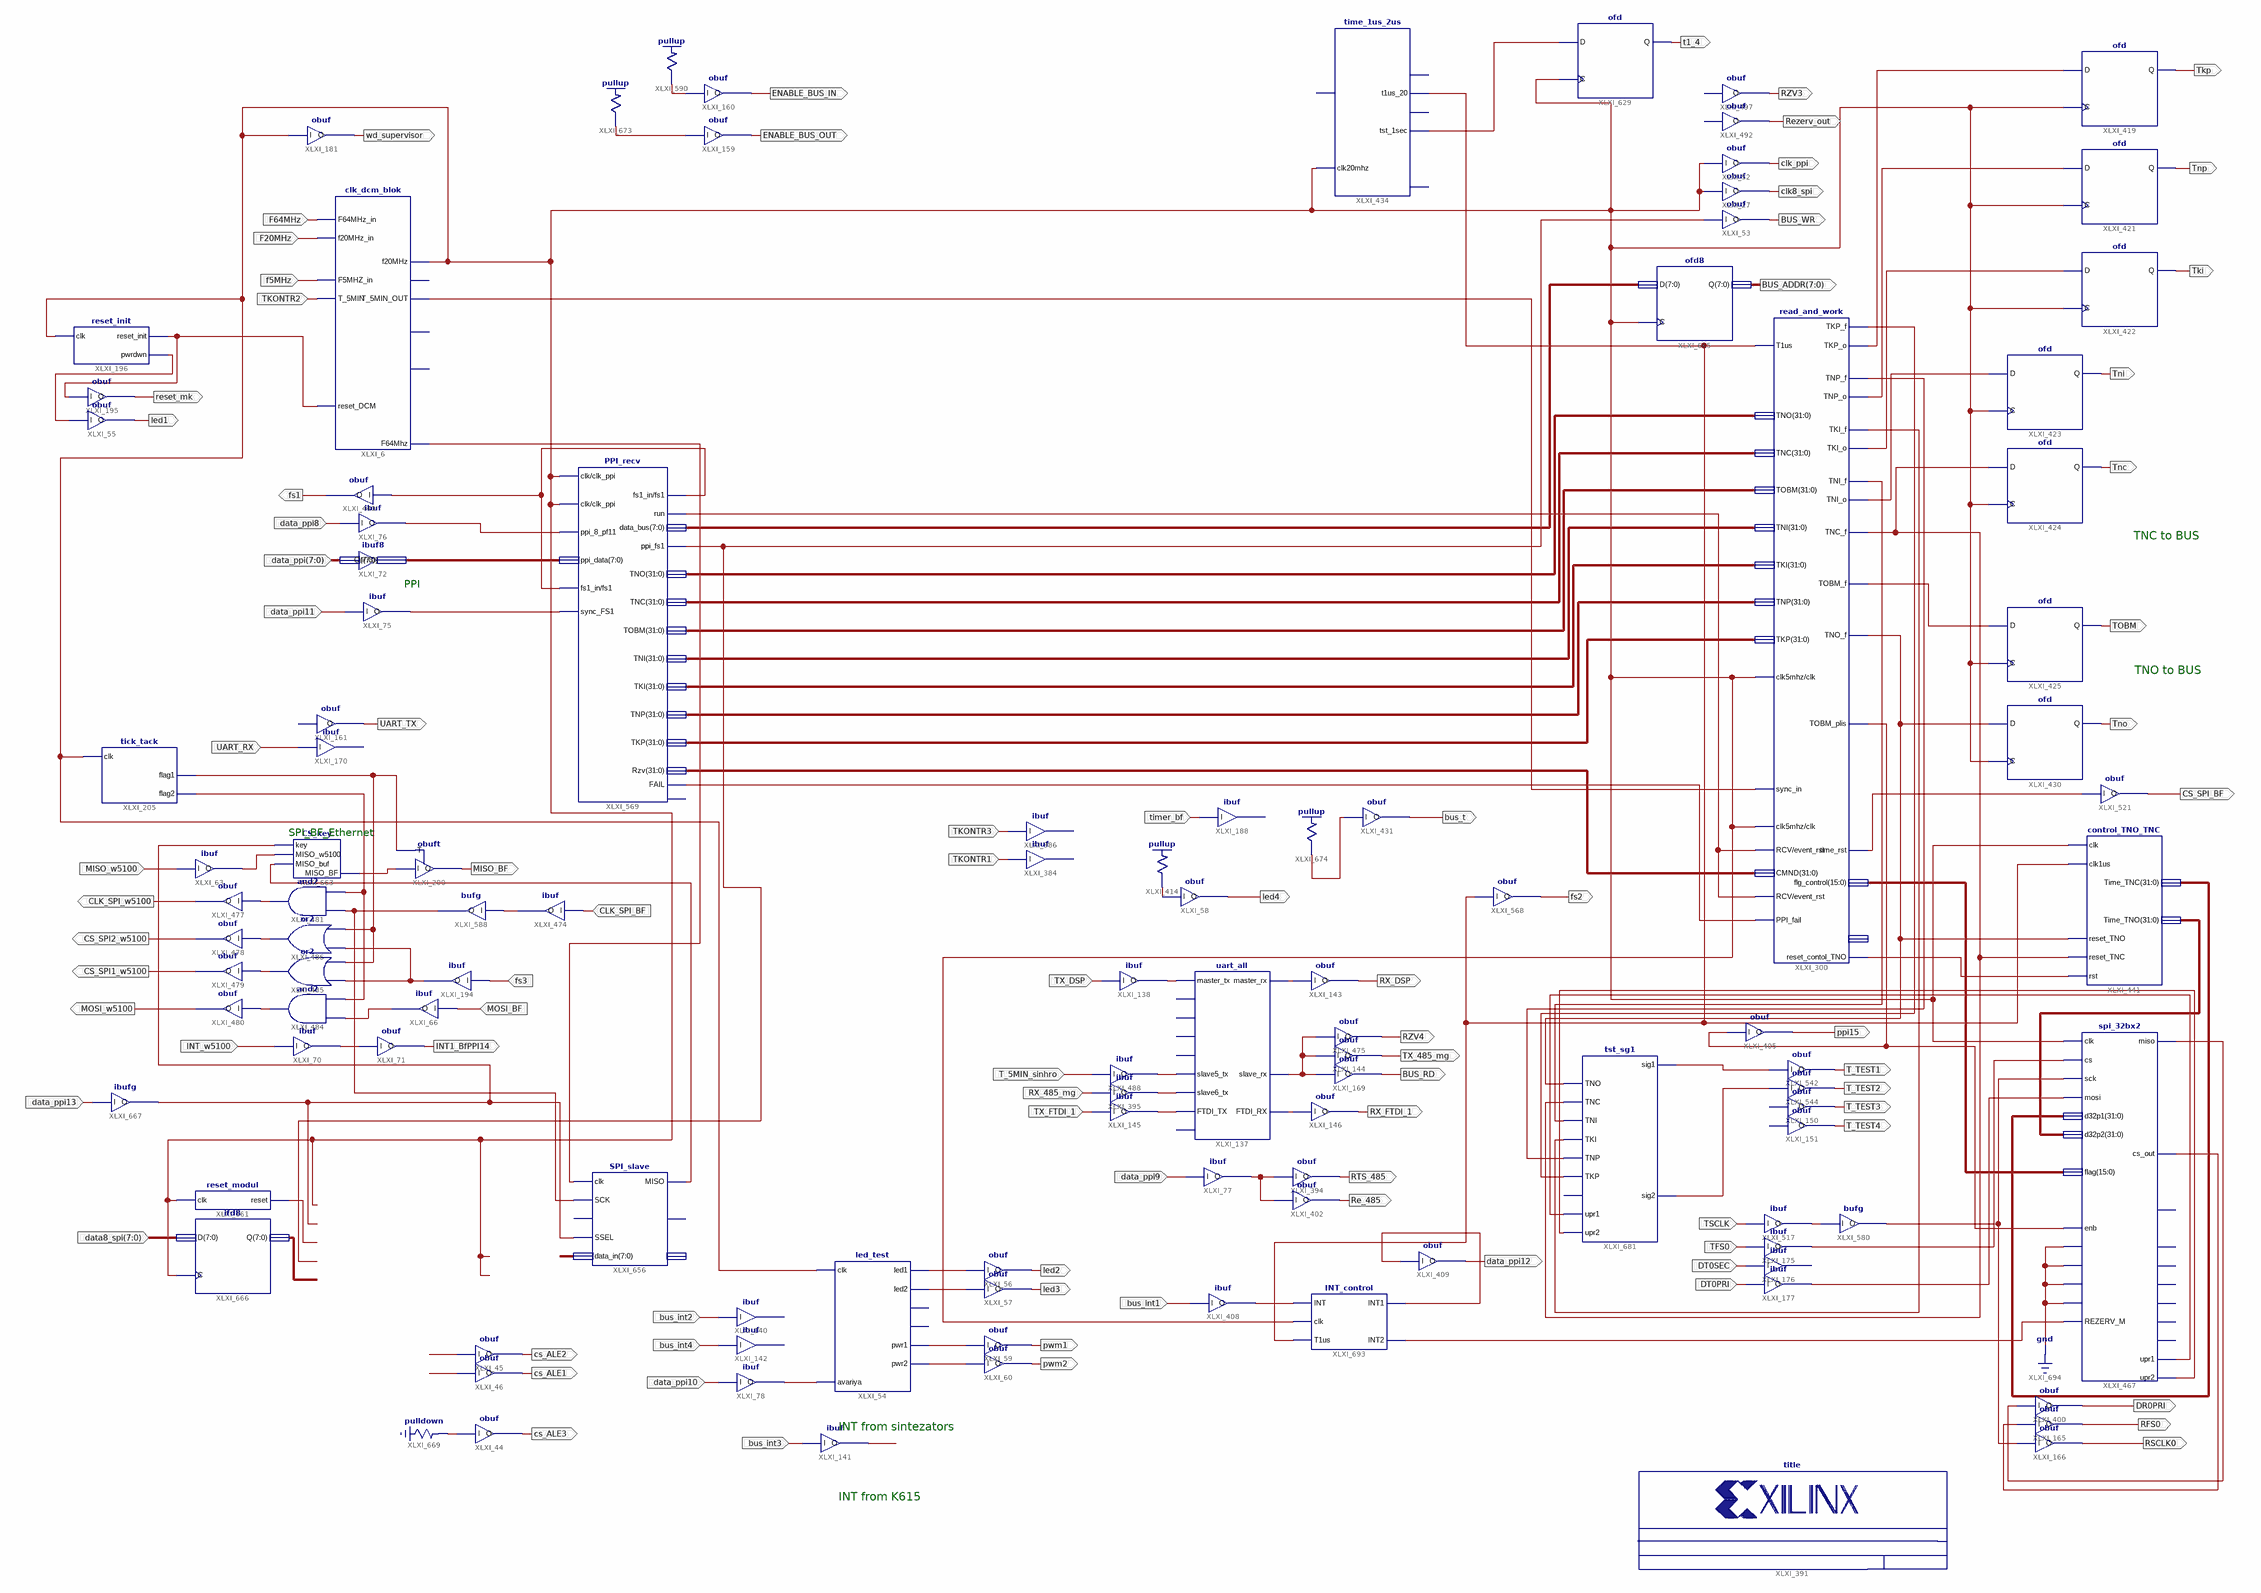
[diagram p0: schematic sheet 1]
// Xilinx ISE schematic MainPage1.sch (spartan3e) as structural Verilog: 109 symbols, 86 ports
module MainPage1 (
  input  data_ppi8,
  input  MOSI_BF,
  input  MISO_w5100,
  input  f5MHz,
  input  F20MHz,
  input  F64MHz,
  input  TKONTR2,
  input  [7:0] data_ppi,
  input  TSCLK,
  input  TFS0,
  input  DT0SEC,
  input  DT0PRI,
  input  fs3,
  input  INT_w5100,
  input  CLK_SPI_BF,
  input  data_ppi13,
  input  [7:0] data8_spi,
  input  data_ppi9,
  input  TX_DSP,
  input  TX_FTDI_1,
  input  RX_485_mg,
  input  T_5MIN_sinhro,
  input  timer_bf,
  input  TKONTR1,
  input  TKONTR3,
  input  UART_RX,
  input  data_ppi11,
  input  data_ppi10,
  input  bus_int3,
  input  bus_int4,
  input  bus_int2,
  input  bus_int1,
  output clk8_spi,
  output clk_ppi,
  output BUS_WR,
  output [7:0] BUS_ADDR,
  output MOSI_w5100,
  output CS_SPI1_w5100,
  output CLK_SPI_w5100,
  output CS_SPI2_w5100,
  output MISO_BF,
  output Tkp,
  output Tnp,
  output Tki,
  output Tni,
  output Tnc,
  output TOBM,
  output Tno,
  output fs1,
  output RFS0,
  output RSCLK0,
  output DR0PRI,
  output Rezerv_out,
  output RZV3,
  output t1_4,
  output wd_supervisor,
  output CS_SPI_BF,
  output T_TEST1,
  output T_TEST2,
  output T_TEST3,
  output T_TEST4,
  output ppi15,
  output fs2,
  output reset_mk,
  output led1,
  output INT1_BfPPI14,
  output RTS_485,
  output Re_485,
  output RX_FTDI_1,
  output TX_485_mg,
  output RZV4,
  output BUS_RD,
  output RX_DSP,
  output led4,
  output bus_t,
  output ENABLE_BUS_OUT,
  output ENABLE_BUS_IN,
  output cs_ALE1,
  output cs_ALE2,
  output cs_ALE3,
  output UART_TX,
  output led3,
  output led2,
  output pwm2,
  output pwm1,
  output data_ppi12
);

  wire XLXN_193, XLXN_335, XLXN_340, XLXN_346, XLXN_379, XLXN_816, XLXN_869, XLXN_1091, XLXN_1092, XLXN_1093,
       XLXN_1094, XLXN_1097, XLXN_1098, XLXN_1109, XLXN_1128, XLXN_1130, XLXN_1131, XLXN_1139, XLXN_1141,
       XLXN_1357, XLXN_1492, XLXN_1497, XLXN_1498, XLXN_1502, XLXN_1503, XLXN_1577, XLXN_1598, XLXN_1614,
       XLXN_1618, XLXN_1663, XLXN_1700, XLXN_1711, XLXN_1712, XLXN_1724, XLXN_1729, XLXN_1735, XLXN_1778,
       XLXN_1779, XLXN_1856, XLXN_1867, XLXN_1874, XLXN_1881, XLXN_1884, XLXN_1887, XLXN_1888, XLXN_1889,
       XLXN_1899, XLXN_1903, XLXN_1931, XLXN_2008, XLXN_2014, XLXN_2023, XLXN_2034, XLXN_2038, XLXN_2039,
       XLXN_2040, XLXN_2057, XLXN_2079, XLXN_2080, XLXN_2081, XLXN_2082, XLXN_2086, XLXN_2087, XLXN_2119,
       XLXN_2121, XLXN_2122, XLXN_2123, XLXN_2124, XLXN_2129, XLXN_2130, XLXN_2131, XLXN_2133, XLXN_2134,
       XLXN_2135, XLXN_2136, XLXN_2139, XLXN_2142;
  wire [7:0] XLXN_1478, XLXN_1890, XLXN_1904, XLXN_1905;
  wire [15:0] XLXN_1528;
  wire [31:0] XLXN_1029, XLXN_1481, XLXN_1482, XLXN_1483, XLXN_1484, XLXN_1485, XLXN_1486, XLXN_1487,
       XLXN_1581, XLXN_1736;

  ibuf XLXI_76 (.I(data_ppi8), .O(XLXN_2038));
  obuf XLXI_53 (.I(XLXN_1903), .O(BUS_WR));
  ibuf XLXI_63 (.I(MISO_w5100), .O(XLXN_1887));
  obuft XLXI_200 (.I(XLXN_1881), .T(XLXN_1097), .O(MISO_BF));
  ibuf XLXI_66 (.I(MOSI_BF), .O(XLXN_1874));
  title XLXI_391 ();
  obuf XLXI_27 (.I(XLXN_2057), .O(clk8_spi));
  obuf XLXI_52 (.I(XLXN_2057), .O(clk_ppi));
  obuf XLXI_440 (.I(XLXN_1899), .O(fs1));
  obuf XLXI_165 (.I(XLXN_1139), .O(RFS0));
  obuf XLXI_166 (.I(XLXN_1141), .O(RSCLK0));
  obuf XLXI_400 (.I(XLXN_1130), .O(DR0PRI));
  obuf XLXI_477 (.I(XLXN_1091), .O(CLK_SPI_w5100));
  obuf XLXI_478 (.I(XLXN_1092), .O(CS_SPI2_w5100));
  obuf XLXI_479 (.I(XLXN_1093), .O(CS_SPI1_w5100));
  obuf XLXI_480 (.I(XLXN_1094), .O(MOSI_w5100));
  and XLXI_481 (XLXN_1091, XLXN_1884, XLXN_1098);
  and XLXI_484 (XLXN_1094, XLXN_1874, XLXN_1098);
  or XLXI_485 (XLXN_1093, XLXN_379, XLXN_1097);
  or XLXI_486 (XLXN_1092, XLXN_379, XLXN_1097);
  ofd XLXI_421 (.C(XLXN_2057), .D(XLXN_2081), .Q(Tnp));
  ofd XLXI_424 (.C(XLXN_2057), .D(XLXN_2133), .Q(Tnc));
  ofd XLXI_425 (.C(XLXN_2057), .D(XLXN_1577), .Q(TOBM));
  obuf XLXI_492 (.O(Rezerv_out));  // open: I
  obuf XLXI_497 (.O(RZV3));  // open: I
  tick_tack XLXI_205 (.clk(XLXN_2057), .flag1(XLXN_1097), .flag2(XLXN_1098));
  ofd XLXI_419 (.C(XLXN_2057), .D(XLXN_2079), .Q(Tkp));
  ibuf8 XLXI_72 (.I(data_ppi), .O(XLXN_1478));
  obuf XLXI_521 (.I(XLXN_1700), .O(CS_SPI_BF));
  ofd XLXI_422 (.C(XLXN_2057), .D(XLXN_2082), .Q(Tki));
  ofd XLXI_430 (.C(XLXN_2057), .D(XLXN_2124), .Q(Tno));
  obuf XLXI_150 (.O(T_TEST3));  // open: I
  obuf XLXI_151 (.O(T_TEST4));  // open: I
  control_TNO_TNC XLXI_441 (
    .clk(XLXN_2057), .clk1us(XLXN_1357), .reset_TNO(XLXN_2124), .reset_TNC(XLXN_2133), .rst(XLXN_1729),
    .Time_TNC(XLXN_1029), .Time_TNO(XLXN_1736));
  obuf XLXI_405 (.I(XLXN_2123), .O(ppi15));
  ibuf XLXI_517 (.I(TSCLK), .O(XLXN_1598));
  ibuf XLXI_175 (.I(TFS0), .O(XLXN_1131));
  ibuf XLXI_176 (.I(DT0SEC));  // open: O
  ibuf XLXI_177 (.I(DT0PRI), .O(XLXN_1128));
  bufg XLXI_580 (.I(XLXN_1598), .O(XLXN_1141));
  bufg XLXI_588 (.I(XLXN_1614), .O(XLXN_1884));
  obuf XLXI_568 (.I(XLXN_1357), .O(fs2));
  PPI_recv XLXI_569 (
    .clk(XLXN_2057), .sync_FS1(XLXN_2039), .clk_ppi(XLXN_2057), .ppi_8_pf11(XLXN_2038), .fs1_in(XLXN_1899),
    .ppi_data(XLXN_1478), .ppi_fs1(XLXN_1903), .fs1(XLXN_1899), .run(XLXN_1711), .FAIL(XLXN_1712),
    .data_bus(XLXN_1904), .TNO(XLXN_1481), .TNC(XLXN_1482), .TOBM(XLXN_1483), .TNI(XLXN_1484),
    .TKI(XLXN_1485), .TNP(XLXN_1486), .TKP(XLXN_1487), .Rzv(XLXN_1581));  // open: tst
  read_and_work XLXI_300 (
    .clk5mhz(XLXN_2057), .sync_in(XLXN_1735), .RCV(XLXN_1711), .T1us(XLXN_1357), .clk(XLXN_2057),
    .event_rst(XLXN_1711), .PPI_fail(XLXN_1712), .TNO(XLXN_1481), .TNC(XLXN_1482), .TOBM(XLXN_1483),
    .TNI(XLXN_1484), .TKI(XLXN_1485), .TNP(XLXN_1486), .TKP(XLXN_1487), .CMND(XLXN_1581), .TKP_f(XLXN_2131),
    .TNP_f(XLXN_2130), .TKI_f(XLXN_2134), .TNI_f(XLXN_2129), .TNC_f(XLXN_2133), .TOBM_f(XLXN_1577),
    .TNO_f(XLXN_2124), .TKP_o(XLXN_2079), .TNP_o(XLXN_2081), .TKI_o(XLXN_2082), .TNI_o(XLXN_2080),
    .TOBM_plis(XLXN_2123), .time_rst(XLXN_1700), .reset_contol_TNO(XLXN_1729), .flg_control(XLXN_1528));  // open: tst_32
  obuf XLXI_181 (.I(XLXN_2057), .O(wd_supervisor));
  ofd XLXI_629 (.C(XLXN_2057), .D(XLXN_1724), .Q(t1_4));
  clk_dcm_blok XLXI_6 (
    .T_5MIN(TKONTR2), .F5MHZ_in(f5MHz), .F64MHz_in(F64MHz), .reset_DCM(XLXN_1779), .f20MHz_in(F20MHz),
    .T_5MIN_OUT(XLXN_1735), .f20MHz(XLXN_2057), .F64Mhz(XLXN_1867));  // open: f5MHZ_out, F21MHz, F20MHz_dcm
  reset_init XLXI_196 (.clk(XLXN_2057), .reset_init(XLXN_1779), .pwrdwn(XLXN_1778));
  obuf XLXI_195 (.I(XLXN_1779), .O(reset_mk));
  obuf XLXI_55 (.I(XLXN_1778), .O(led1));
  ofd XLXI_423 (.C(XLXN_2057), .D(XLXN_2080), .Q(Tni));
  ibuf XLXI_194 (.I(fs3), .O(XLXN_379));
  ibuf XLXI_70 (.I(INT_w5100), .O(XLXN_193));
  obuf XLXI_71 (.I(XLXN_193), .O(INT1_BfPPI14));
  ibuf XLXI_474 (.I(CLK_SPI_BF), .O(XLXN_1614));
  reset_modul XLXI_661 (.clk(XLXN_2057), .reset(XLXN_1856));
  SPI_slave XLXI_656 (
    .clk(XLXN_1867), .SCK(XLXN_1884), .SSEL(XLXN_1889), .data_in(XLXN_1890), .MISO(XLXN_1888));  // open: MOSI, redy, data_out
  CS_key XLXI_663 (.key(XLXN_1889), .MISO_w5100(XLXN_1887), .MISO_buf(XLXN_1888), .MISO_BF(XLXN_1881));
  ofd8 XLXI_665 (.C(XLXN_2057), .D(XLXN_1904), .Q(BUS_ADDR));
  ifd8 XLXI_666 (.C(XLXN_2057), .D(data8_spi), .Q(XLXN_1905));
  ibufg XLXI_667 (.I(data_ppi13), .O(XLXN_1889));
  obuf XLXI_542 (.I(XLXN_2086), .O(T_TEST1));
  obuf XLXI_544 (.I(XLXN_2087), .O(T_TEST2));
  ibuf XLXI_77 (.I(data_ppi9), .O(XLXN_2142));
  obuf XLXI_394 (.I(XLXN_2142), .O(RTS_485));
  obuf XLXI_402 (.I(XLXN_2142), .O(Re_485));
  uart_all XLXI_137 (
    .master_tx(XLXN_335), .slave5_tx(XLXN_1109), .slave6_tx(XLXN_816), .FTDI_TX(XLXN_346),
    .master_rx(XLXN_340), .slave_rx(XLXN_2139), .FTDI_RX(XLXN_1931));  // open: rts, slave1_tx, slave2_tx, slave3_tx, slave4_tx
  obuf XLXI_146 (.I(XLXN_1931), .O(RX_FTDI_1));
  obuf XLXI_144 (.I(XLXN_2139), .O(TX_485_mg));
  obuf XLXI_475 (.I(XLXN_2139), .O(RZV4));
  obuf XLXI_169 (.I(XLXN_2139), .O(BUS_RD));
  obuf XLXI_143 (.I(XLXN_340), .O(RX_DSP));
  ibuf XLXI_138 (.I(TX_DSP), .O(XLXN_335));
  ibuf XLXI_145 (.I(TX_FTDI_1), .O(XLXN_346));
  ibuf XLXI_395 (.I(RX_485_mg), .O(XLXN_816));
  ibuf XLXI_488 (.I(T_5MIN_sinhro), .O(XLXN_1109));
  obuf XLXI_58 (.I(XLXN_869), .O(led4));
  \pullup  XLXI_414 (.O(XLXN_869));
  ibuf XLXI_188 (.I(timer_bf));  // open: O
  ibuf XLXI_384 (.I(TKONTR1));  // open: O
  ibuf XLXI_386 (.I(TKONTR3));  // open: O
  obuf XLXI_431 (.I(XLXN_2040), .O(bus_t));
  obuf XLXI_159 (.I(XLXN_2034), .O(ENABLE_BUS_OUT));
  obuf XLXI_160 (.I(XLXN_1618), .O(ENABLE_BUS_IN));
  \pullup  XLXI_590 (.O(XLXN_1618));
  obuf XLXI_46 (.I(XLXN_2023), .O(cs_ALE1));
  obuf XLXI_45 (.I(XLXN_2014), .O(cs_ALE2));
  obuf XLXI_44 (.I(XLXN_2008), .O(cs_ALE3));
  \pulldown  XLXI_669 (.O(XLXN_2008));
  time_1us_2us XLXI_434 (
    .clk20mhz(XLXN_2057), .t1us_20(XLXN_1357), .tst_1sec(XLXN_1724));  // open: clk64, t1us_64, t1us_tau10, t1_min
  obuf XLXI_161 (.O(UART_TX));  // open: I
  ibuf XLXI_170 (.I(UART_RX));  // open: O
  \pullup  XLXI_673 (.O(XLXN_2034));
  ibuf XLXI_75 (.I(data_ppi11), .O(XLXN_2039));
  \pullup  XLXI_674 (.O(XLXN_2040));
  spi_32bx2 XLXI_467 (
    .clk(XLXN_2057), .cs(XLXN_1131), .sck(XLXN_1141), .mosi(XLXN_1128), .enb(XLXN_2123), .INT2(1'b0),
    .INT3(1'b0), .INT4(1'b0), .ERROR64(1'b0), .REZERV_M(XLXN_2122), .d32p1(XLXN_1029), .d32p2(XLXN_1736),
    .flag(XLXN_1528), .cs_out(XLXN_1139), .miso(XLXN_1130), .upr1(XLXN_2136), .upr2(XLXN_2135));  // open: rst_event, ALE1, ALE2, ALE3, ERROR, event_int, GBR
  led_test XLXI_54 (
    .clk(XLXN_2057), .led1(XLXN_1497), .led2(XLXN_1498), .pwr1(XLXN_1502), .pwr2(XLXN_1503),
    .avariya(XLXN_1492));  // open: led3, led4
  ibuf XLXI_78 (.I(data_ppi10), .O(XLXN_1492));
  obuf XLXI_57 (.I(XLXN_1498), .O(led3));
  obuf XLXI_56 (.I(XLXN_1497), .O(led2));
  obuf XLXI_60 (.I(XLXN_1503), .O(pwm2));
  obuf XLXI_59 (.I(XLXN_1502), .O(pwm1));
  ibuf XLXI_141 (.I(bus_int3), .O(XLXN_1663));
  ibuf XLXI_142 (.I(bus_int4));  // open: O
  ibuf XLXI_140 (.I(bus_int2));  // open: O
  INT_control XLXI_693 (.INT(XLXN_2119), .clk(XLXN_2057), .T1us(XLXN_1357), .INT1(XLXN_2121), .INT2(XLXN_2122));
  ibuf XLXI_408 (.I(bus_int1), .O(XLXN_2119));
  obuf XLXI_409 (.I(XLXN_2121), .O(data_ppi12));
  tst_sg1 XLXI_681 (
    .TNO(XLXN_2124), .TNC(XLXN_2133), .TNI(XLXN_2129), .TKI(XLXN_2134), .TNP(XLXN_2130), .TKP(XLXN_2131),
    .sig1(XLXN_2086), .sig2(XLXN_2087), .upr1(XLXN_2136), .upr2(XLXN_2135));  // open: TOBM

  // Notes on the sheet:
  //   TNC to BUS
  //   PPI
  //   TNO to BUS
  //   SPI_BF_Ethernet
  //   INT from sintezators
  //   INT from K615
endmodule
